# Altium schematic sheet modulator.SchDoc
size A4
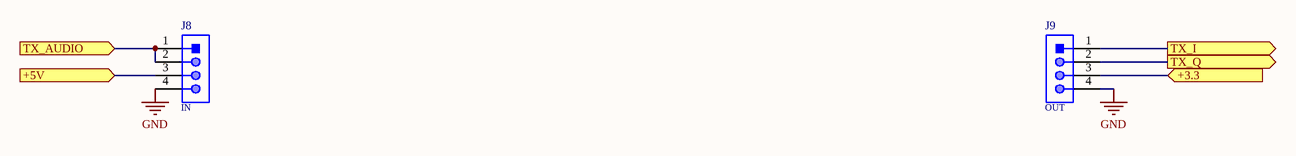
[diagram p0: modulator.SchDoc]

## Parts
J8  IN  [61300411121]
J9  OUT  [61300411121]

## Ports
+3.3 (in), +5V (in), TX_AUDIO (in), TX_I (out), TX_Q (out)

## Nets
GND: J8.4 J9.4
+3.3: J9.3 ; port +3.3
+5V: J8.3 ; port +5V
TX_AUDIO: J8.1 J8.2 ; port TX_AUDIO
TX_I: J9.1 ; port TX_I
TX_Q: J9.2 ; port TX_Q

## Library data of the parts
J8 J9 = CMP-1502-01064-1: THT Vertical Pin Header WR-PHD, Pitch 2.54 mm, Single Row, 4 pins; Manufacturer: Wurth Elektronik; Withstanding Voltage: 500VAC; Rated Current: 3A; Working Voltage: 250VAC; Pin Number: 4; Gender: Male; Contact Resistance: 20mOhm; Pitch: 2.54mm; Manufacturer URL: http://www.we-online.de; Operating Temperature: -40to105degC; Packaging: Bag; Mounting Technology: THT; Package Reference: 61300411121; Datasheet URL: https://katalog.we-online.de/em/datasheet/6130xx11121.pdf; Publisher: WurthElektronik; Part Number: 61300411121; Row Number: Single; Orientation: Vertical